# EAGLE design DC Motor controller V2 (EAGLE 4.14)
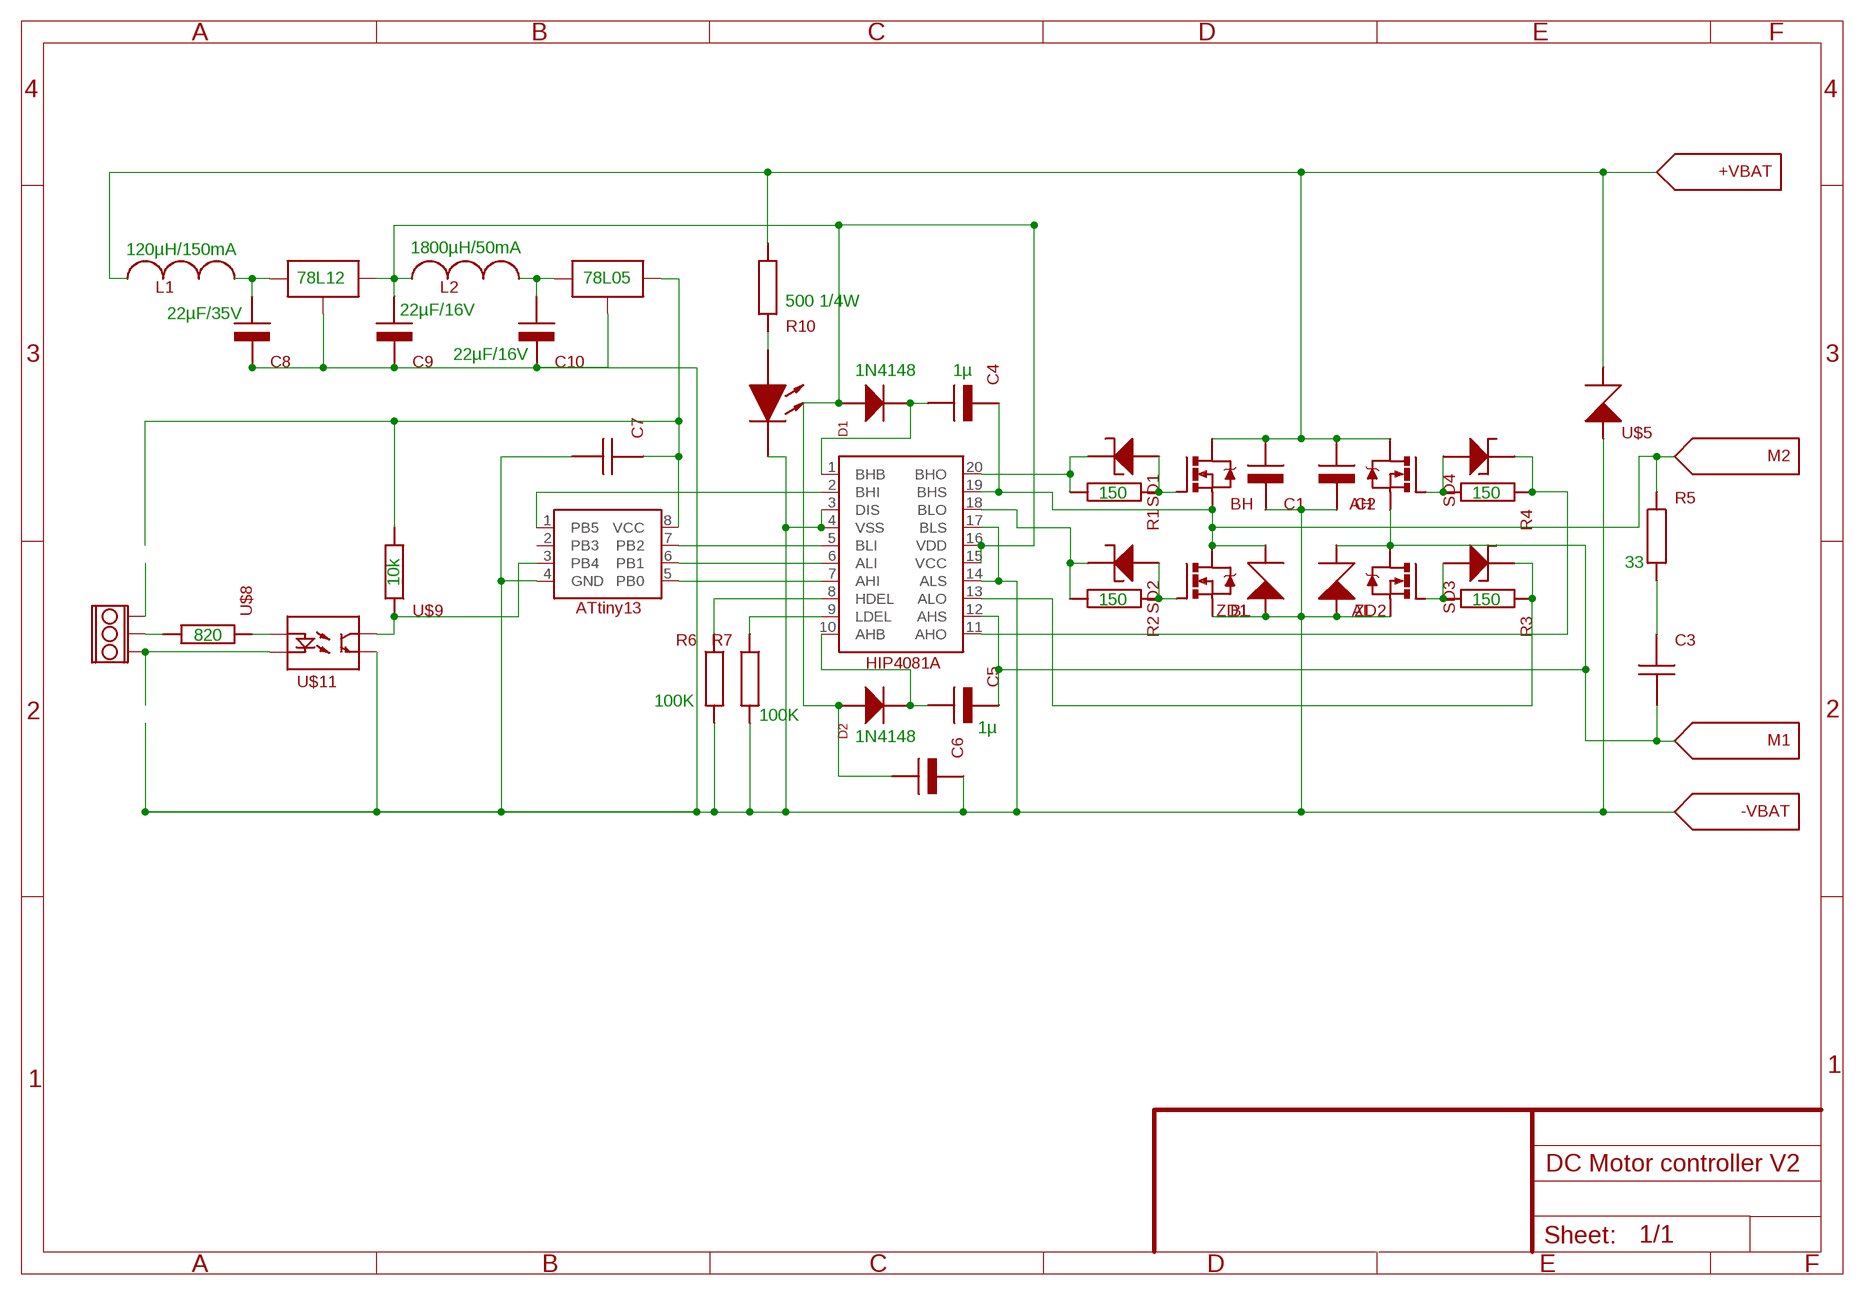
[diagram p0: schematic, sheet 1]

## Parts
78L05  VOLTAGE_REGULATOR_78XXTO92  [TO92]
78L12  VOLTAGE_REGULATOR_78XXTO92  [TO92]
+VBAT  SCREW_CONNECTION_3MM  [SCREW_SOLDERPATH_3MM]
-VBAT  SCREW_CONNECTION_3MM  [SCREW_SOLDERPATH_3MM]
AH  FET_POWER_MOSFETTO220_V  [TO220_VERTICAL]
AL  FET_POWER_MOSFETTO220_V  [TO220_VERTICAL]
BH  FET_POWER_MOSFETTO220_V  [TO220_VERTICAL]
BL  FET_POWER_MOSFETTO220_V  [TO220_VERTICAL]
C1  C_POLARIZEDC_E_V_4  [C_E_V_4]
C2  C_POLARIZEDC_E_V_4  [C_E_V_4]
C3  0.1 µF/100V  C_POLYESTERPOLYSTER_H_3  [C_POLYESTER_2]
C4  C_POLARIZEDTANTALUM_3MM  [C_TANTALUM_3MM]
C5  C_POLARIZEDTANTALUM_3MM  [C_TANTALUM_3MM]
C6  C_POLARIZEDTANTALUM_3MM  [C_TANTALUM_3MM]
C7  0.1µF/50V  C_POLYESTERPOLYESTER_25MM  [C_POLYESTER_1]
C8  C_POLARIZEDTANTALUM_5MM  [C_TANTALUM_5MM]
C9  22µF/16V  C_POLARIZEDTANTALUM_5MM  [C_TANTALUM_5MM]
C10  22µF/16V  C_POLARIZEDTANTALUM_5MM  [C_TANTALUM_5MM]
D1  DD_H_2  [D_H_2]
D2  DD_H_2  [D_H_2]
L1  LL_H_4  [L_4_H]
L2  LL_H_4  [L_4_H]
M1  SCREW_CONNECTION_3MM  [SCREW_SOLDERPATH_3MM]
M2  SCREW_CONNECTION_3MM  [SCREW_SOLDERPATH_3MM]
R1  RR_H_3  [R_H_3]
R2  RR_H_3  [R_H_3]
R3  RR_H_3  [R_H_3]
R4  RR_H_3  [R_H_3]
R5  RR_H_4  [R_H_4]
R6  RR_H_4  [R_H_4]
R7  RR_H_4  [R_H_4]
R10  RR_H_4  [R_H_4]
SD1  MBR1100  D_SCHOTTKYD_H_3  [D_H_3]
SD2  MBR1100  D_SCHOTTKYD_H_3  [D_H_3]
SD3  MBR1100  D_SCHOTTKYD_H_3  [D_H_3]
SD4  MBR1100  D_SCHOTTKYD_H_3  [D_H_3]
U$1  HIP4081ADIL20  [DIL20]
U$5  D_ZENERD_H_5  [D_H_5]
U$8  RR_H_3  [R_H_3]
U$9  10k  RR_H_3  [R_H_3]
U$10  ATTINY13  [ATTINY13]
U$11  OPTOCOUPLER_1DIL4  [DIL4]
U$12  SCREW_HEADER_3  [SCREW_HEADER_3]
U$14  LED  [LED_V_1]
ZD1  D_ZENERD_V_1  [D_V_1]
ZD2  D_ZENERD_V_1  [D_V_1]

## Nets
N$1: 78L05.1(IN) C10.PLUS L2.P$2
N$2: R10.P$3 U$14.A
N$3: +VBAT.P$1 AH.D BH.D C1.+(PLUS) C2.+(PLUS) L1.P$1 R10.P$2 U$5.K
N$4: 78L12.1(IN) C8.PLUS L1.P$2
N$5: U$12.TOP
N$7: U$11.2 U$12.BOTTOM
N$8: U$9.1 U$10.3(PB4) U$11.4
N$10: U$8.2 U$12.CENTER
N$11: 78L05.3(OUT) C7.P$2 U$9.2 U$10.8(VCC)
N$12: U$8.1 U$11.1
N$13: R1.2 SD1.K U$1.20(BHO)
N$14: R7.P$3 U$1.9(LDEL)
N$15: R6.P$3 U$1.8(HDEL)
N$16: U$1.7(AHI) U$10.5(PB0)
N$17: U$1.6(ALI) U$10.6(PB1)
N$18: U$1.5(BLI) U$10.7(PB2)
N$19: U$1.2(BHI) U$10.1(PB5)
N$20: C4.PLUS D1.K U$1.1(BHB)
N$21: C5.PLUS D2.K U$1.10(AHB)
N$22: 78L05.2(GND) 78L12.2(GND) -VBAT.P$1 AL.S BL.S C1.-(MINUS) C2.-(MINUS) C6.MINUS C7.P$1 C8.MINUS C9.MINUS C10.MINUS R6.P$2 R7.P$2 U$1.3(DIS) U$1.4(VSS) U$1.14(ALS) U$1.17(BLS) U$5.A U$10.4(GND) U$11.3 U$14.K ZD1.A ZD2.A
N$23: 78L12.3(OUT) C6.PLUS C9.PLUS D1.A D2.A L2.P$1 U$1.15(VCC) U$1.16(VDD)
N$24: R2.2 SD2.K U$1.18(BLO)
N$25: BL.G R2.1 SD2.A
N$26: BH.G R1.1 SD1.A
N$29: AL.G R3.2 SD3.A
N$30: AH.G R4.2 SD4.A
N$31: R3.1 SD3.K U$1.13(ALO)
N$32: R4.1 SD4.K U$1.11(AHO)
N$36: BH.S BL.D C4.MINUS M2.P$1 R5.P$3 U$1.19(BHS) ZD1.K
N$37: C3.P$2 R5.P$2
N$38: AH.S AL.D C3.P$1 C5.MINUS M1.P$1 U$1.12(AHS) ZD2.K
Unconnected: U$10.2(PB3)

## Notes on the sheet
- 120µH/150mA | 1800µH/50mA
- 78L12 | 78L05
- 500 1/4W
- 22µF/35V | 22µF/16V
- 22µF/16V
- 1N4148 | 1µ
- 150 | 150
- 33
- 10k
- 150 | 150
- 820
- 100K
- 100K
- 1µ
- 1N4148

## Library data of the parts
78L05 78L12 = 0_Lib:VOLTAGE_REGULATOR_78XX
+VBAT -VBAT M1 M2 = 0_Lib:SCREW_CONNECTION_3MM
AH AL BH BL = 0_Lib:FET_POWER_MOSFET
C1 C2 C4-C6 C8-C10 = 0_Lib:C_POLARIZED
C3 C7 = 0_Lib:C_POLYESTER
D1 D2 = 0_Lib:D
L1 L2 = 0_Lib:L
R1-R7 R10 U$8 U$9 = 0_Lib:R
SD1-SD4 = 0_Lib:D_SCHOTTKY
U$1 = 0_Lib:HIP4081A
U$5 ZD1 ZD2 = 0_Lib:D_ZENER
U$10 = 0_Lib:ATTINY13
U$11 = 0_Lib:OPTOCOUPLER_1
U$12 = 0_Lib:SCREW_HEADER_3
U$14 = 0_Lib:LED

## Board
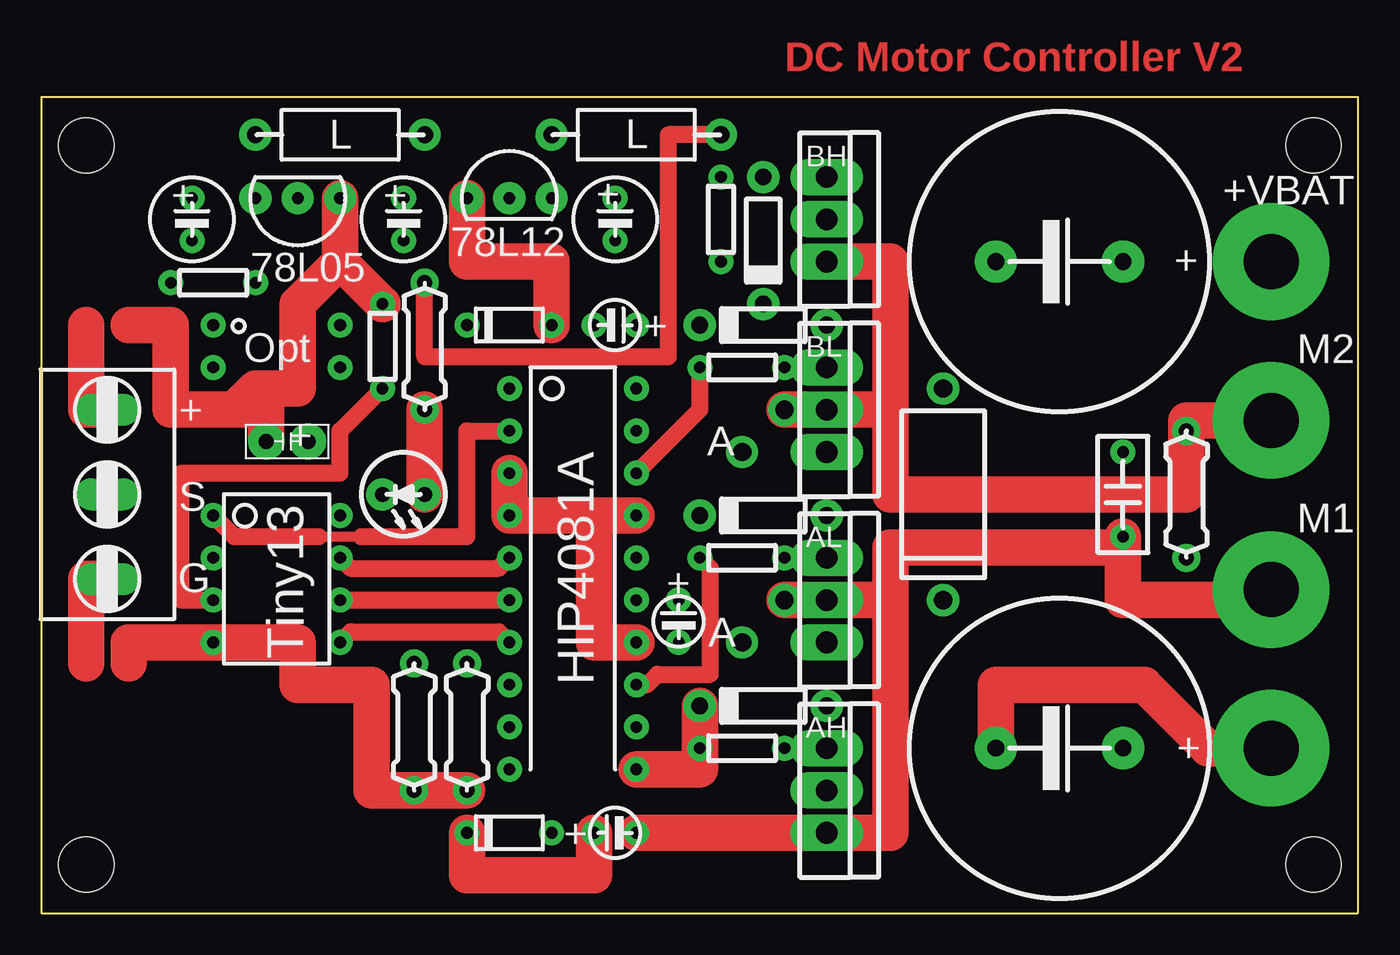
[diagram p1: board, top side]
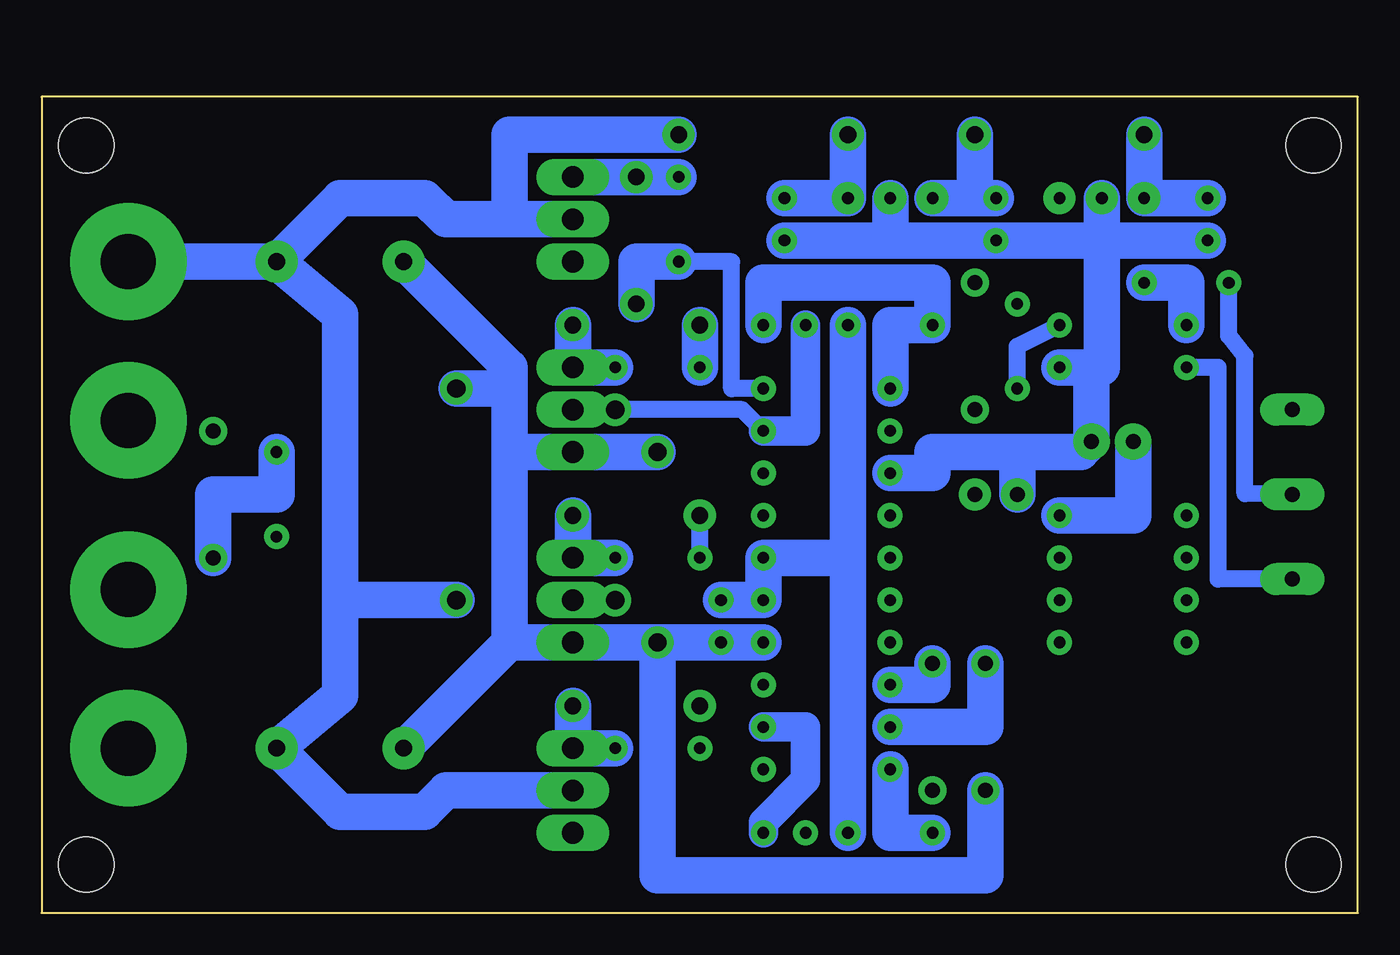
[diagram p2: board, bottom side, seen from below]

Size 79 x 49 mm. Coordinates in mm from the lower left corner, seen from the top.
Copper layers (1*16): Top 0.035mm / dielectric 1.5mm / Bottom 0.035mm
Design rules "default": minimum track width 10mil, minimum drill 24mil, track to track 8mil, track to pad 8mil, pad to pad 8mil, via to via 8mil, smd to smd 8mil, copper to edge 40mil, drill to drill 8mil, minimum pad ring 10mil, minimum via ring 8mil, stop-mask expansion 4mil, vias tented up to drill 0mil, thermal gap 10mil

### Footprints (pad centres in the part's own frame; a part is rotated, then mirrored left to right if it is on the bottom)
TO92 = drill 0.7 pad 1.93 round: 1 -2.54,0; 2 0,0; 3 2.54,0
SCREW_SOLDERPATH_3MM = drill 3.3 pad 7 round: P$1 0,0
TO220_VERTICAL = drill 1.3 pad 2.184 long: D 0,0; G -2.54,0; S 2.54,0
C_E_V_4 = drill 1 pad 2.54 round: + -3.81,0; - 3.81,0
C_POLYESTER_2 = drill 0.7 pad 1.5 round: P$1 0,-2.54; P$2 0,2.54
C_TANTALUM_3MM = drill 0.7 pad 1.5 round: MINUS 0,-1.27; PLUS 0,1.27
C_POLYESTER_1 = drill 0.9 pad 2.184 round: P$1 -1.25,0; P$2 1.25,0
C_TANTALUM_5MM = drill 0.7 pad 1.5 round: MINUS 0,-1.27; PLUS 0,1.27
D_H_2 = drill 0.7 pad 1.5 round: A 2.54,0; K -2.54,0
L_4_H = drill 1 pad 1.93 round: P$1 -5.08,0; P$2 5.08,0
R_H_3 = drill 0.7 pad 1.5 round: 1 -2.54,0; 2 2.54,0
R_H_4 = drill 0.9 pad 1.676 round: P$2 -3.81,0; P$3 3.81,0
D_H_3 = drill 1 pad 1.93 round: A 3.81,0; K -3.81,0
DIL20 = drill 0.7 pad 1.5 round: 1 -3.81,11.43; 2 -3.81,8.89; 3 -3.81,6.35; 4 -3.81,3.81; 5 -3.81,1.27; 6 -3.81,-1.27; 7 -3.81,-3.81; 8 -3.81,-6.35; 9 -3.81,-8.89; 10 -3.81,-11.43; 11 3.81,-11.43; 12 3.81,-8.89; 13 3.81,-6.35; 14 3.81,-3.81; 15 3.81,-1.27; 16 3.81,1.27; 17 3.81,3.81; 18 3.81,6.35; 19 3.81,8.89; 20 3.81,11.43
D_H_5 = drill 1.1 pad 1.93 round: A 6.35,0; K -6.35,0
PCB_TEMPLATE_80X50 = hole 3.3: 2.54,2.54; 2.54,45.72; 76.2,45.72; 76.2,2.54
ATTINY13 = drill 0.7 pad 1.5 round: 1 -3.81,3.81; 2 -3.81,1.27; 3 -3.81,-1.27; 4 -3.81,-3.81; 5 3.81,-3.81; 6 3.81,-1.27; 7 3.81,1.27; 8 3.81,3.81
DIL4 = drill 0.7 pad 1.5 round: 1 -3.81,1.27; 2 -3.81,-1.27; 3 3.81,-1.27; 4 3.81,1.27
SCREW_HEADER_3 = drill 0.9 pad 1.93 long: BOTTOM 0,-5.08; CENTER 0,0; TOP 0,5.08
LED_V_1 = drill 0.9 pad 1.93 round: A 0,1.27; K 0,-1.27
D_V_1 = drill 1.1 pad 1.93 round: A 0,0; K 2.54,2.54

### Placement (x,y rotation side)
78L05  15.37,42.91 0 top
78L12  28.07,42.91 180 top
+VBAT  73.79,39.1 0 top
-VBAT  73.79,9.89 0 top
AH  47.12,7.36 270 top
AL  47.12,18.79 270 top
BH  47.12,41.64 270 top
BL  47.12,30.21 270 top
C1  61.09,39.1 180 top
C2  61.09,9.89 180 top
C3  64.9,25.13 0 top
C4  34.42,35.3 270 top
C5  34.42,4.82 90 top
C6  38.23,17.52 0 top
C7  14.73,28.31 180 top
C8  34.42,41.64 0 top
C9  21.72,41.64 0 top
C10  9.02,41.64 0 top
D1  28.07,35.3 0 top
D2  28.07,4.82 0 top
L1  35.69,46.73 180 top
L2  17.91,46.73 180 top
M1  73.79,19.42 0 top
M2  73.79,29.58 0 top
R1  40.77,41.64 270 top
R2  42.04,32.76 180 top
R3  42.04,21.32 0 top
R4  42.04,9.89 0 top
R5  68.71,25.13 90 top
R6  25.53,11.16 90 top
R7  22.36,11.16 90 top
R10  22.99,34.02 270 top
SD1  43.31,40.38 90 top
SD2  43.31,35.3 0 top
SD3  43.31,23.86 0 top
SD4  43.31,12.43 0 top
U$1  31.88,20.05 0 top
U$5  54.1,25.13 90 top
U$6  [PCB_TEMPLATE_80X50]  0.13,0.37 0 top
U$8  10.29,37.84 180 top
U$9  20.45,34.02 90 top
U$10  14.1,20.05 0 top
U$11  14.1,34.02 0 top
U$12  3.94,25.13 0 top
U$14  21.72,25.13 270 top
ZD1  42.04,27.68 0 top
ZD2  42.04,16.25 0 top

### Tracks (layer width: path | path; a pad name or v marks a point on that pad's centre or on a via)
N$1
  Bottom 2.184: L2.P$2 78L05.1 C10.PLUS
N$2
  Top 2.184: U$14.A R10.P$3
N$3
  Top 1.016: R10.P$2 22.99,33.39 37.59,33.39 37.59,46.73 L1.P$1
  Bottom 2.184: 61.09,18.79 61.09,13.07 C2.+ 61.09,6.08 56.01,6.08 54.74,7.36 AH.D | 61.09,18.79 61.09,35.93 C1.+ | C1.+ +VBAT.P$1 | 50.93,41.64 54.74,41.64 56.01,42.91 61.09,42.91 C1.+ | 50.93,41.64 BH.D | L1.P$1 50.93,46.73 50.93,41.64 | 61.09,18.79 U$5.K
N$4
  Bottom 2.184: 78L12.1 C8.PLUS 78L12.1 | 78L12.1 L1.P$2
N$5
  Top 2.184: U$12.TOP 2.67,30.21 2.67,35.3
N$7
  Top 2.184: 2.67,14.97 2.67,20.05 U$12.BOTTOM
  Bottom 1.016: U$12.BOTTOM 8.38,20.05 8.38,32.76 U$11.2
N$8
  Top 1.016: U$9.1 17.91,28.95 17.91,26.41 8.38,26.41 8.38,18.79 U$10.3
  Bottom 1.016: U$11.4 20.45,34.02 U$9.1
N$10
  Bottom 1.016: U$12.CENTER 6.79,25.19 6.79,33.44 7.75,34.66 U$8.2
N$11
  Top 2.184: 17.91,39.1 78L05.3 | 17.91,39.1 U$9.2 | 17.91,39.1 15.37,36.56 15.37,31.48 12.83,31.48 11.56,30.21 | 11.56,30.21 7.75,30.21 7.75,35.3 5.21,35.3 | 11.56,30.21 13.46,30.21 13.46,28.31 C7.P$2
  Bottom 2.184: 15.37,23.86 U$10.8 13.48,23.86 C7.P$2
N$12
  Bottom 2.184: U$11.1 10.29,37.84 U$8.1
N$13
  Bottom 1.016: R1.2 37.59,39.1 37.59,31.48 U$1.20
  Bottom 2.184: SD1.K 43.31,39.1 R1.2
N$14
  Bottom 2.184: R7.P$3 22.36,11.16 U$1.9
N$15
  Bottom 2.184: R6.P$3 25.53,13.71 U$1.8
N$16
  Top 1.016: U$10.5 18.54,16.88 27.43,16.88 U$1.7
N$17
  Top 1.016: U$10.6 U$1.6
N$18
  Top 1.016: U$10.7 18.54,20.69 27.43,20.69 U$1.5
N$19
  Top 0.61: 16.64,22.59 19.18,22.59
  Top 1.016: U$10.1 11.56,22.59 16.64,22.59 | 19.18,22.59 25.53,22.59 25.53,28.95 U$1.2
N$20
  Bottom 2.184: U$1.1 28.07,35.3 D1.K 25.53,37.84 35.69,37.84 C4.PLUS
N$21
  Top 2.184: C5.PLUS 33.15,2.27 25.53,2.27 D2.K
  Bottom 2.184: D2.K 28.07,4.82 U$1.10
N$22
  Top 2.184: -VBAT.P$1 69.98,9.89 66.17,13.71 57.28,13.71 C2.- | U$1.14 33.15,16.25 33.15,23.86 | 33.15,23.86 U$1.17 | R7.P$2 R6.P$2 R7.P$2 | U$1.3 U$1.4 33.15,23.86 | R7.P$2 19.81,7.36 19.81,13.71 15.37,13.71 15.37,16.25 U$10.4 5.21,16.25 5.21,14.97
  Bottom 2.184: 15.37,40.38 C9.MINUS 28.07,40.38 | 28.07,40.38 C8.MINUS | 28.07,40.38 78L12.2 | 15.37,40.38 78L05.2 | 15.37,40.38 15.37,32.76 16,32.76 | 16,32.76 U$11.3 | 50.93,16.25 C2.- | 50.93,16.25 50.93,27.68 | 50.93,27.68 50.93,31.48 | 50.93,31.48 50.93,32.76 C1.- | U$1.14 C6.MINUS ZD2.A | ZD2.A AL.S 50.93,16.25 | BL.S ZD1.A 50.93,27.68 | R7.P$2 22.36,2.27 42.04,2.27 ZD2.A | 15.37,40.38 C10.MINUS | 50.93,31.48 U$5.A | U$1.3 25.53,26.41 25.53,27.68 20.45,27.68 | 20.45,27.68 U$14.K | 16,32.76 15.98,32.73 C7.P$1 16,28.31 16.64,27.68 20.45,27.68
N$23
  Top 2.184: 78L12.3 25.53,39.1 30.61,39.1 D1.A
  Bottom 2.184: 22.99,42.91 C9.PLUS | 78L12.3 22.99,42.91 | 22.99,42.91 L2.P$1 | D2.A 30.61,21.32 | 30.61,21.32 D1.A | C6.PLUS U$1.15 U$1.16 30.61,21.32
N$24
  Top 1.016: U$1.18 39.5,30.21 R2.2
  Bottom 2.184: R2.2 SD2.K
N$25
  Bottom 2.184: R2.1 BL.G SD2.A
N$26
  Bottom 2.184: BH.G SD1.A R1.1
N$29
  Bottom 2.184: SD3.A AL.G R3.2
N$30
  Bottom 2.184: SD4.A AH.G R4.2
N$31
  Top 1.016: R3.1 40.13,20.69 40.13,14.34 36.96,14.34 36.33,13.71 U$1.13
  Bottom 1.016: R3.1 SD3.K
N$32
  Top 2.184: U$1.11 39.5,8.62 R4.1 SD4.K
N$36
  Top 2.184: 50.93,30.21 50.93,25.13 68.71,25.13 R5.P$3 68.71,29.58 M2.P$1 | 50.93,30.21 BL.D ZD1.K | BH.S 50.93,39.1 50.93,30.21
  Bottom 1.016: U$1.19 36.96,30.21 ZD1.K
  Bottom 1.778: U$1.19 33.15,28.95 C4.MINUS
N$37
  Bottom 2.184: R5.P$2 68.71,25.13 64.9,25.13 C3.P$2
N$38
  Top 1.016: AL.D ZD2.K
  Top 2.184: 50.93,18.79 AL.D ZD2.K | 50.93,18.79 50.93,4.82 AH.S C5.MINUS | 64.9,21.96 64.9,18.79 73.79,18.79 M1.P$1 | 64.9,21.96 C3.P$1 | 64.9,21.96 50.93,21.96 50.93,18.79
  Bottom 1.778: C5.MINUS 35.69,5.45 33.15,7.99 33.15,11.16 U$1.12

### Text on the board
Top: DC Motor Controller V2
Bottom: DC Motor Controller V2
tPlace: L | L | + | + | + | 78L12 | + | 78L05 | + | Opt | + | + | A | S | G | + | A | HIP4081A | + | +
tStop: DC Motor Controller V2
bStop: DC Motor Controller V2
Drill_legend: Drill legend | Date: 28/02/2006 18:23:25 | 1 different diameters with default symbols! (8 drills) | 3.3000 mm / 129.921 mil | 1.3000 mm / 51.181 mil | 1.1000 mm / 43.307 mil | 1.0000 mm / 39.370 mil | 0.9000 mm / 35.433 mil | 0.7000 mm / 27.559 mil